# EAGLE design LCD Serial Adapter (EAGLE 7.6.0)
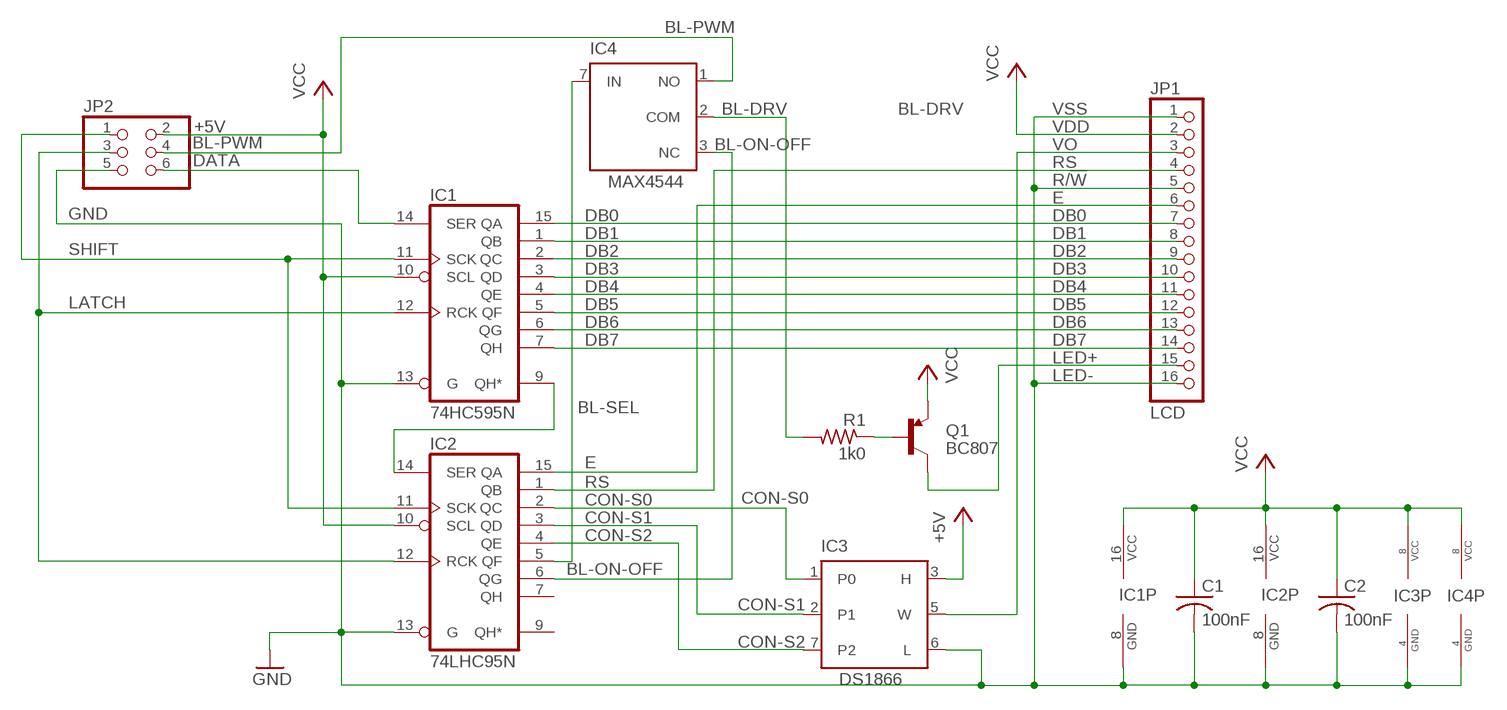
[diagram p0: schematic, sheet 1]

## Parts
C1  100nF  C-USSMD  [C0402]
C2  100nF  C-USSMD  [C0402]
IC1  74HC595N  74LS595D  [SO16]
IC2  74LHC95N  74LS595D  [SO16]
IC3  DS1866Z  [SOIC8]
IC4  MAX4544  MAX4544CSA  [SOIC8]
JP1  LCD  PINHD-1X16  [1X16]
JP2  PINHD-2X3  [2X03]
Q1  BC807  [SOT23-3]
R1  1k0  R-USSMD  [RES-VERT]

## Nets
+5V: IC1.10(SCL) IC2.10(SCL) IC3.3(H) JP1.2 JP2.2 Q1.2(E) ; supply symbol labelled VCC
BL-DRV: IC4.2(COM) R1.2
BL-ON-OFF: IC2.6(QG) IC4.3(NC)
BL-PWM: IC4.1(NO) JP2.4
BL-SEL: IC2.5(QF) IC4.7(IN)
CON-S0: IC2.2(QC) IC3.1(P0)
CON-S1: IC2.3(QD) IC3.2(P1)
CON-S2: IC2.4(QE) IC3.7(P2)
DATA: IC1.14(SER) JP2.6
DB0: IC1.15(QA) JP1.7
DB1: IC1.1(QB) JP1.8
DB2: IC1.2(QC) JP1.9
DB3: IC1.3(QD) JP1.10
DB4: IC1.4(QE) JP1.11
DB5: IC1.5(QF) JP1.12
DB6: IC1.6(QG) JP1.13
DB7: IC1.7(QH) JP1.14
E: IC2.15(QA) JP1.6
GND: C1.2 C2.2 IC1.8(GND) IC1.13(G) IC2.8(GND) IC2.13(G) IC3.4(GND) IC3.6(L) IC4.4(GND) JP1.1 JP1.5 JP1.16 JP2.5
LATCH: IC1.12(RCK) IC2.12(RCK)
LED+: JP1.15 Q1.3(C)
N$7: IC1.9(QH*) IC2.14(SER)
N$21: Q1.1(B) R1.1
RS: IC2.1(QB) JP1.4
SHIFT: IC1.11(SCK) IC2.11(SCK) JP2.1
VCC: C1.1 C2.1 IC1.16(VCC) IC2.16(VCC) IC3.8(VCC) IC4.8(VCC)
VO: IC3.5(W) JP1.3
Unconnected: IC2.7(QH) IC2.9(QH*) IC4.5(N.C.) IC4.6(N.C.) JP2.3

## Notes on the sheet
- VSS
- VDD
- R/!W
- LED-

## Library data of the parts
C1 C2 = 00 Nik misc:C-US: Capactor, ceramic
IC1 IC2 = 74xx-us:74*595: 8-bit SHIFT REGISTER, output latch
IC3 = 00 Nik misc:DS1866: Single 8-position Log Trimmer Potentiometer 5-dB/step
IC4 = 00 Nik misc:MAX4544: SPDT Analog Switch
JP1 = pinhead:PINHD-1X16: PIN HEADER
JP2 = pinhead:PINHD-2X3: PIN HEADER
Q1 = 00 Nik misc:BC: BC327/807 PNP BJT
R1 = 00 Nik misc:R-US: Resistor

## Board
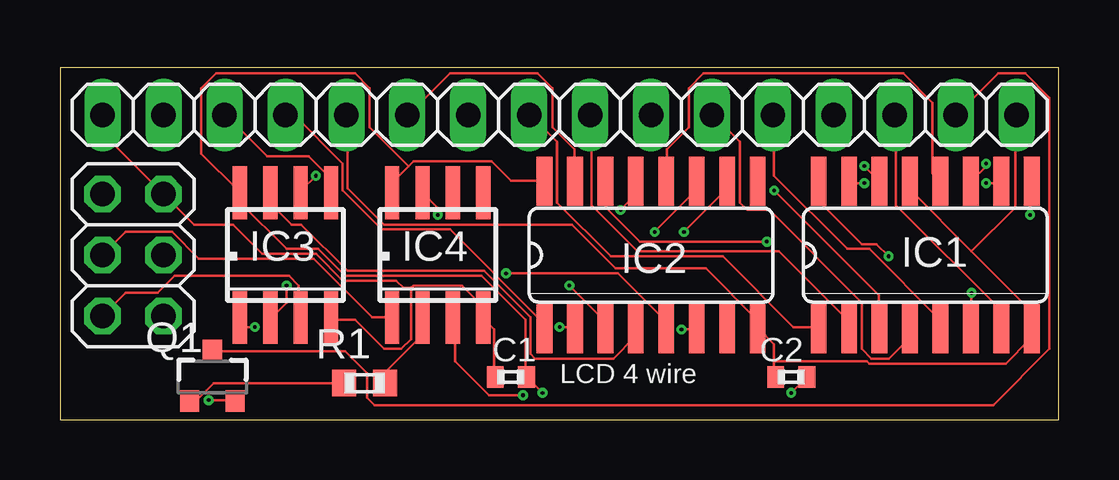
[diagram p1: board, top side]
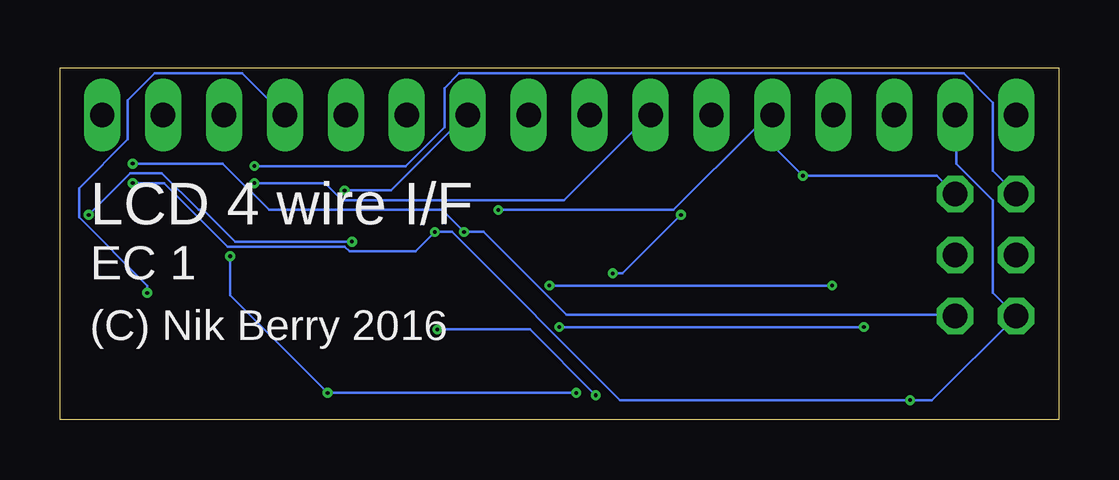
[diagram p2: board, bottom side, seen from below]

Size 41.64 x 14.66 mm. Coordinates in mm from the lower left corner, seen from the top.
Outline: 0,0 41.64,0 41.64,14.66 0,14.66 0,0
Copper layers (1*16): Top 0.035mm / dielectric 1.5mm / Bottom 0.035mm
Design rules "SparkFun-2-layer-FAB-LIMIT": minimum track width 4mil, minimum drill 6mil, track to track 4mil, track to pad 4mil, pad to pad 4mil, via to via 4mil, smd to smd 4mil, copper to edge 4mil, drill to drill 4mil, minimum pad ring 5mil, minimum via ring 5mil, stop-mask expansion 4mil, vias tented up to drill 25mil, thermal gap 10mil

### Footprints (pad centres in the part's own frame; a part is rotated, then mirrored left to right if it is on the bottom)
C0402 = smd 0.7 x 0.9: 1 -0.65,0; 2 0.65,0
SO16 = smd 0.66 x 2.032: 1 -4.445,-3.073; 2 -3.175,-3.073; 3 -1.905,-3.073; 4 -0.635,-3.073; 5 0.635,-3.073; 6 1.905,-3.073; 7 3.175,-3.073; 8 4.445,-3.073; 9 4.445,3.073; 10 3.175,3.073; 11 1.905,3.073; 12 0.635,3.073; 13 -0.635,3.073; 14 -1.905,3.073; 15 -3.175,3.073; 16 -4.445,3.073
SOIC8 = smd 0.6 x 2.2: 1 -1.905,-2.6; 2 -0.635,-2.6; 3 0.635,-2.6; 4 1.905,-2.6; 5 1.905,2.6; 6 0.635,2.6; 7 -0.635,2.6; 8 -1.905,2.6
1X16 = drill 1.016 long: 1 -19.05,0; 2 -16.51,0; 3 -13.97,0; 4 -11.43,0; 5 -8.89,0; 6 -6.35,0; 7 -3.81,0; 8 -1.27,0; 9 1.27,0; 10 3.81,0; 11 6.35,0; 12 8.89,0; 13 11.43,0; 14 13.97,0; 15 16.51,0; 16 19.05,0
2X03 = drill 1.016 octagon: 1 -2.54,-1.27; 2 -2.54,1.27; 3 0,-1.27; 4 0,1.27; 5 2.54,-1.27; 6 2.54,1.27
SOT23-3 = smd 0.8 x 0.9: 1 -0.95,-1; 2 0.95,-1; 3 0,1.1
RES-VERT = smd 1 x 1.1: 1 -0.85,0; 2 0.85,0

### Placement (x,y rotation side)
C1  18.8,1.78 180 top
C2  30.48,1.78 180 top
IC1  36.07,6.86 0 top
IC2  24.64,6.86 0 top
IC3  9.4,6.86 0 top
IC4  15.75,6.86 0 top
JP1  20.83,12.7 0 top
JP2  3.05,6.86 90 top
Q1  6.35,1.78 0 top
R1  12.7,1.52 0 top

### Tracks (layer width: path | path; a pad name or v marks a point on that pad's centre or on a via)
+5V  (via drill 0.15)
  Top 0.102: v6.2,0.81 7.21,0.81 Q1.2 | v26.01,7.82 27.74,9.55 27.74,9.85 IC2.10 | v38.61,9.85 39.22,9.85 IC1.10 | JP2.2 2.74,5.28 4.06,5.28 4.78,5.99 9.55,5.99 9.96,5.59 9.96,4.27 IC3.3
  Bottom 0.102: v38.61,9.85 37.29,9.85 34.65,7.21 29.77,7.21 29.57,7.01 26.82,7.01 v26.01,7.82 25.3,7.82 18.29,0.81 v6.2,0.81 5.28,0.81 JP2.2 2.74,5.28 2.74,9.14 4.27,10.67 4.27,12.7 JP1.2
BL-DRV
  Top 0.102: R1.2 13.61,1.52 13.61,2.03 15.04,3.45 15.04,4.17 IC4.2
BL-ON-OFF  (via drill 0.15)
  Top 0.102: v25.91,3.76 26.52,3.76 IC2.6 | v19.3,1.02 17.88,1.02 16.46,2.44 16.46,4.17 IC4.3
  Bottom 0.102: v25.91,3.76 22.05,3.76 v19.3,1.02
BL-PWM
  Top 0.102: JP2.4 2.74,7.82 4.67,7.82 5.79,6.71 10.57,6.71 13,4.27 13.82,4.27 IC4.1
BL-SEL  (via drill 0.15)
  Top 0.102: v18.59,6.1 23.27,6.1 25.2,4.17 25.2,3.86 IC2.5 | v15.75,8.53 15.75,8.84 15.14,9.45 IC4.7
  Bottom 0.102: v18.59,6.1 18.19,6.1 v15.75,8.53
CON-S0  (via drill 0.15)
  Top 0.102: v20.83,3.86 21.44,3.86 IC2.2 | v8.13,3.86 7.82,3.86 7.52,4.17 IC3.1
  Bottom 0.102: v8.13,3.86 v20.83,3.86
CON-S1  (via drill 0.15)
  Top 0.102: v21.23,5.59 22.66,4.17 22.66,3.86 IC2.3 | v9.45,5.59 9.45,4.88 8.84,4.27 IC3.2
  Bottom 0.102: v9.45,5.59 v21.23,5.59
CON-S2
  Top 0.102: IC2.4 23.98,3.76 23.98,3.45 23.06,2.54 19.81,2.54 19.61,2.74 19.61,4.27 17.68,6.2 11.99,6.2 10.06,8.13 9.65,8.13 8.84,8.94 8.84,9.45 IC3.7
DATA  (via drill 0.15)
  Top 0.102: v33.53,10.57 IC1.14
  Bottom 0.102: v33.53,10.57 27.23,10.57 25.6,12.19 25.6,13.82 24.99,14.43 3.96,14.43 2.74,13.21 2.74,10.36 JP2.6
DB0  (via drill 0.15)
  Top 0.102: v33.53,9.85 32.92,9.85 IC1.15
  Bottom 0.102: v33.53,9.85 30.58,9.85 29.87,9.14 20.63,9.14 17.07,12.7 JP1.7
DB1
  Top 0.102: IC1.1 31.6,3.86 30.58,3.86 27.64,6.81 22.96,6.81 20.73,9.04 20.73,11.58 19.61,12.7 JP1.8
DB2
  Top 0.102: IC1.2 32.82,3.86 32.82,4.17 29.97,7.01 24.08,7.01 22.15,8.94 22.15,12.7 JP1.9
DB3  (via drill 0.15)
  Top 0.102: v29.77,9.55 34.14,5.18 34.14,3.86 IC1.3
  Bottom 0.102: v29.77,9.55 27.84,9.55 24.69,12.7 JP1.10
DB4
  Top 0.102: IC1.4 35.36,3.76 35.36,3.35 34.54,2.54 33.83,2.54 33.43,2.95 33.43,4.88 29.57,8.74 28.65,8.74 28.35,9.04 28.35,11.58 27.23,12.7 JP1.11
DB5
  Top 0.102: IC1.5 36.68,3.86 36.68,4.17 33.73,7.11 32.82,7.11 29.77,10.16 29.77,12.7 JP1.12
DB6  (via drill 0.15)
  Top 0.102: v38,5.28 38,3.86 IC1.6
  Bottom 0.102: v38,5.28 38,5.59 40.84,8.43 40.84,9.65 38.81,11.68 38.81,13.31 37.69,14.43 34.04,14.43 32.31,12.7 JP1.13
DB7
  Top 0.102: IC1.7 39.22,3.86 39.22,4.57 34.85,8.94 34.85,12.7 JP1.14
E
  Top 0.102: IC2.15 21.44,9.96 21.44,11.28 20.52,12.19 20.52,13.82 19.91,14.43 16.26,14.43 14.53,12.7 JP1.6
GND  (via drill 0.15)
  Top 0.102: 29.77,2.44 29.77,3.15 29.16,3.76 IC2.8 29.06,3.86 29.06,4.17 26.92,6.3 23.17,6.3 21.34,8.13 13.51,8.13 11.99,9.65 11.99,12.7 JP1.5 | 29.77,2.44 29.77,1.83 C2.2 | 38,7.01 35.46,9.55 35.46,9.85 IC1.13 | 38,7.01 40.44,4.57 40.44,3.86 IC1.8 40.44,3.76 40.44,3.35 39.42,2.34 33.73,2.34 33.63,2.44 29.77,2.44 | 38,7.01 39.83,8.84 39.83,12.7 JP1.16 | v23.37,8.74 23.98,9.35 23.98,9.85 IC2.13 | v10.67,10.16 10.06,9.55 IC3.6 | C1.2 18.08,1.83 18.08,3.76 17.68,4.17 IC4.4 17.58,4.27 17.58,4.78 16.76,5.59 14.73,5.59 14.63,5.49 | 14.63,5.49 14.63,3.35 14.22,2.95 13.51,2.95 12.29,4.17 11.38,4.17 IC3.4 | JP1.1 1.83,12.7 1.83,11.89 JP2.5 5.59,8.13 7.21,8.13 8.43,6.91 10.67,6.91 11.79,5.79 14.02,5.79 14.33,5.49 14.63,5.49
  Bottom 0.102: v23.37,8.74 16.05,8.74 12.6,12.19 | 12.6,12.19 12.09,12.7 JP1.5 12.6,12.19 | 12.6,12.19 12.6,12.09 v10.67,10.16 5.08,10.16 JP2.5
LATCH
  Top 0.102: IC1.12 36.37,10.26 36.37,13.21 35.15,14.43 26.82,14.43 26.21,13.82 26.21,12.19 25.3,11.28 25.3,9.96 IC2.12
LED+
  Top 0.102: Q1.3 6.4,2.85 11.89,2.85 12.8,1.93 12.8,0.91 13.11,0.61 38.91,0.61 41.25,2.95 41.25,13.41 40.23,14.43 39.12,14.43 37.39,12.7 JP1.15
N$7  (via drill 0.15)
  Top 0.102: v29.46,7.42 24.18,7.42 22.76,8.84 22.76,9.85 IC2.14 | v40.44,8.53 40.44,9.85 IC1.9
  Bottom 0.102: v29.46,7.42 34.34,7.42 35.66,8.74 35.86,8.74 37.39,10.26 38.71,10.26 v40.44,8.53
N$21
  Top 0.102: R1.1 6.4,1.52 5.69,0.81 5.49,0.81 Q1.1
RS
  Top 0.102: JP1.4 9.75,12.7 11.79,10.67 11.79,9.55 13.41,7.93 16.26,7.93 20.12,4.06 20.12,3.86 IC2.1
SHIFT  (via drill 0.15)
  Top 0.102: v24.79,7.82 26.52,9.55 26.52,9.85 IC2.11 | IC1.11 38.61,10.57 v38.61,10.67
  Bottom 0.102: JP2.1 4.37,4.37 20.52,4.37 23.98,7.82 v24.79,7.82 25.71,8.74 32.92,8.74 34.85,10.67 v38.61,10.67
VCC  (via drill 0.15)
  Top 0.102: 14.53,10.57 13.92,9.96 13.92,9.55 IC4.8 | 14.53,10.57 14.73,10.77 17.98,10.77 18.8,9.96 20.12,9.96 IC2.16 | v30.48,1.12 31.09,1.73 C2.1 | v20.12,1.12 19.51,1.73 C1.1 19.41,1.83 19.41,4.17 17.58,5.99 11.89,5.99 10.77,7.11 9.45,7.11 7.52,9.04 7.52,9.45 IC3.8 7.42,9.55 5.89,11.07 5.89,13.82 6.5,14.43 12.29,14.43 12.9,13.82 12.9,12.19 14.53,10.57 | v34.54,6.81 34.04,7.31 33.43,7.31 31.7,9.04 31.7,9.85 IC1.16
  Bottom 0.102: v20.12,1.12 v30.48,1.12 34.54,5.18 v34.54,6.81
VO
  Top 0.102: IC3.5 11.28,9.55 11.28,10.06 10.36,10.97 8.64,10.97 6.91,12.7 JP1.3

### Text on the board
tNames: LCD 4 wire
bNames: LCD 4 wire I/F | EC 1 | (C) Nik Berry 2016